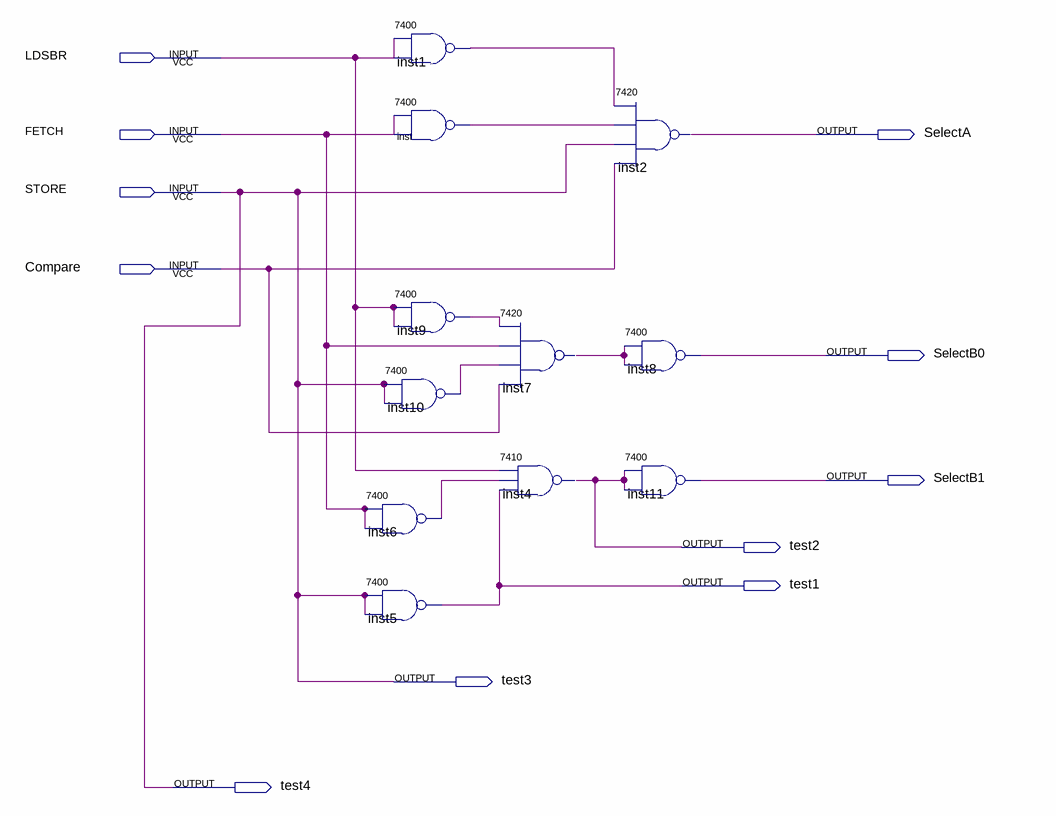
[diagram p0: schematic sheet]
// Quartus schematic ControlLogic.bdf as structural Verilog: 11 symbols, 11 pins
module ControlLogic (
  input  LDSBR,
  input  FETCH,
  input  STORE,
  input  Compare,
  output SelectA,
  output SelectB0,
  output SelectB1,
  output test2,
  output test1,
  output test3,
  output test4
);

  wire inst1_1, inst6_1, inst7_1, inst9_1, inst10_1, inst_1;

  \7400  inst1 (.\3 (LDSBR), .\2 (LDSBR), .\1 (inst1_1));
  \7400  inst (.\3 (FETCH), .\2 (FETCH), .\1 (inst_1));
  \7400  inst9 (.\3 (LDSBR), .\2 (LDSBR), .\1 (inst9_1));
  \7400  inst10 (.\3 (STORE), .\2 (STORE), .\1 (inst10_1));
  \7400  inst6 (.\3 (FETCH), .\2 (FETCH), .\1 (inst6_1));
  \7400  inst5 (.\3 (STORE), .\2 (STORE), .\1 (test1));
  \7420  inst7 (.\4 (inst10_1), .\2 (inst9_1), .\3 (FETCH), .\5 (Compare), .\1 (inst7_1));
  \7410  inst4 (.\2 (LDSBR), .\3 (inst6_1), .\4 (test1), .\1 (test2));
  \7420  inst2 (.\4 (STORE), .\2 (inst1_1), .\3 (inst_1), .\5 (Compare), .\1 (SelectA));
  \7400  inst8 (.\3 (inst7_1), .\2 (inst7_1), .\1 (SelectB0));
  \7400  inst11 (.\3 (test2), .\2 (test2), .\1 (SelectB1));

  assign test3 = STORE;
  assign test4 = STORE;
endmodule
